# Altium schematic sheet CLKB_main.SchDoc
size A3
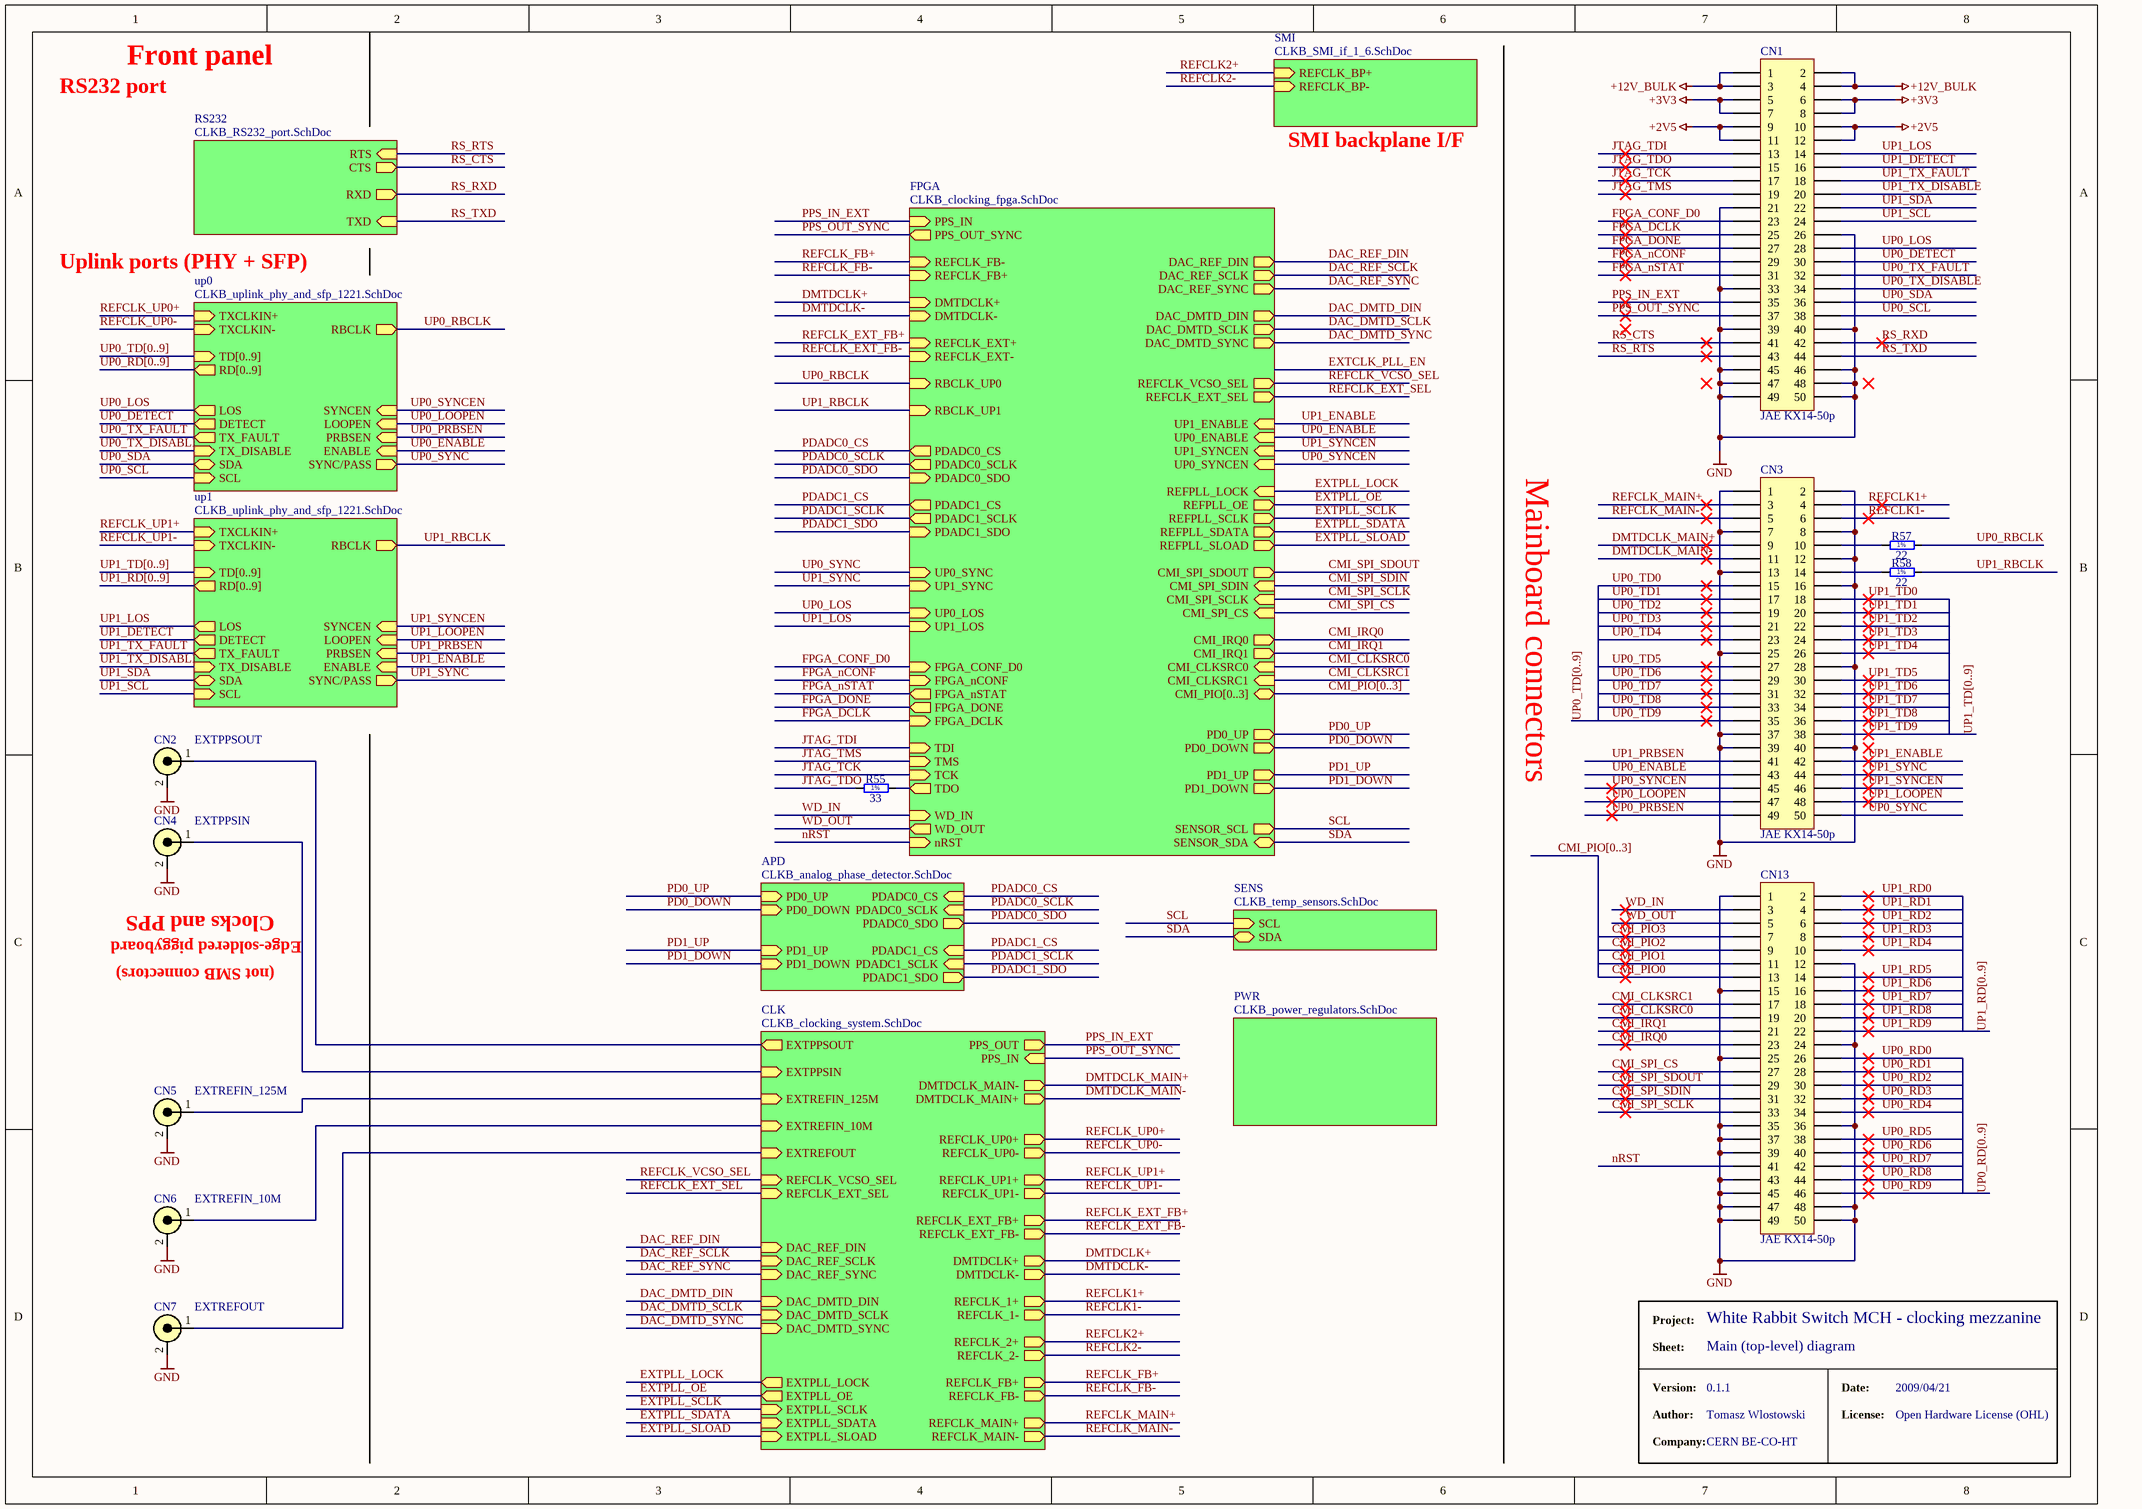
[diagram p0: CLKB_main.SchDoc]

## Parts
CN1  JAE KX14-50p  [JAE_KX14_50P]
CN2  EXTPPSOUT  [MCH_SPECIAL_FP_CLOCKS]
CN3  JAE KX14-50p  [JAE_KX14_50P]
CN4  EXTPPSIN  [MCH_SPECIAL_FP_CLOCKS]
CN5  EXTREFIN_125M  [MCH_SPECIAL_FP_CLOCKS]
CN6  EXTREFIN_10M  [MCH_SPECIAL_FP_CLOCKS]
CN7  EXTREFOUT  [MCH_SPECIAL_FP_CLOCKS]
CN13  JAE KX14-50p  [JAE_KX14_50P]
R55  33  [RESC1608X55N]
R57  22  [RESC1608X55N]
R58  22  [RESC1608X55N]

## Sub-sheets
APD = CLKB_analog_phase_detector.SchDoc: PDADC1_SDO (out), PD0_UP (in), PDADC1_CS (in), PD1_DOWN (in), PD0_DOWN (in), PDADC0_CS (in), PDADC0_SDO (out), PDADC1_SCLK (in), PDADC0_SCLK (in), PD1_UP (in)
CLK = CLKB_clocking_system.SchDoc: EXTREFIN_10M (in), EXTREFIN_125M (in), REFCLK_EXT_SEL (in), EXTREFOUT (in), REFCLK_MAIN+ (out), REFCLK_MAIN- (out), REFCLK_FB+ (out), REFCLK_FB- (out), REFCLK_UP0+ (out), REFCLK_1- (out), REFCLK_2+ (out), REFCLK_2- (out), REFCLK_UP1- (out), REFCLK_1+ (out), DMTDCLK+ (out), DMTDCLK- (out), REFCLK_EXT_FB+ (out), REFCLK_EXT_FB- (out), DAC_DMTD_SYNC (in), DAC_DMTD_SCLK (in), DAC_DMTD_DIN (in), DAC_REF_SYNC (in), DAC_REF_SCLK (in), REFCLK_UP1+ (out), DAC_REF_DIN (in), REFCLK_UP0- (out), DMTDCLK_MAIN+ (out), DMTDCLK_MAIN- (out), REFCLK_VCSO_SEL (in), EXTPPSIN (in), PPS_IN (in), PPS_OUT (out), EXTPPSOUT (out), EXTPLL_LOCK (out), EXTPLL_OE (out), EXTPLL_SLOAD (in), EXTPLL_SDATA (in), EXTPLL_SCLK (in)
FPGA = CLKB_clocking_fpga.SchDoc: TDI (in), TDO (out), TCK (in), TMS (in), REFCLK_FB- (in), DMTDCLK+ (in), DMTDCLK- (in), REFCLK_EXT+ (in), REFCLK_EXT- (in), RBCLK_UP0 (in), RBCLK_UP1 (in), CMI_SPI_SDIN (in), CMI_SPI_SCLK (in), UP0_LOS (in), CMI_SPI_CS (in), CMI_SPI_SDOUT (out), UP1_LOS (in), FPGA_DCLK (in), DAC_REF_SYNC (out), DAC_REF_DIN (out), DAC_REF_SCLK (out), DAC_DMTD_SYNC (out), DAC_DMTD_SCLK (out), DAC_DMTD_DIN (out), CMI_IRQ0 (out), CMI_IRQ1 (out), CMI_CLKSRC0 (in), CMI_CLKSRC1 (in), CMI_PIO[0..3] (bidir), REFCLK_VCSO_SEL (out), REFCLK_EXT_SEL (out), UP0_SYNC (in), PDADC0_CS (out), PDADC0_SDO (in), PDADC0_SCLK (out), UP1_SYNC (in), FPGA_CONF_D0 (in), PDADC1_CS (out), PDADC1_SDO (in), PDADC1_SCLK (out), PD0_UP (out), PD0_DOWN (out), PD1_UP (out), PD1_DOWN (out), FPGA_DONE (out), FPGA_nCONF (in), FPGA_nSTAT (out), REFCLK_FB+ (in), UP1_ENABLE (in), UP0_ENABLE (in), UP1_SYNCEN (in), UP0_SYNCEN (in), WD_IN (in), WD_OUT (out), nRST (in), SENSOR_SCL (out), SENSOR_SDA (bidir), REFPLL_OE (out), REFPLL_SCLK (out), REFPLL_SDATA (out), REFPLL_SLOAD (out), REFPLL_LOCK (in), PPS_IN (in), PPS_OUT_SYNC (out)
PWR = CLKB_power_regulators.SchDoc: no entries
RS232 = CLKB_RS232_port.SchDoc: TXD (in), RXD (out), CTS (out), RTS (in)
SENS = CLKB_temp_sensors.SchDoc: SDA (bidir), SCL (in)
SMI = CLKB_SMI_if_1_6.SchDoc: REFCLK_BP+ (in), REFCLK_BP- (in)
up0 = CLKB_uplink_phy_and_sfp_1221.SchDoc: TD[0..9] (in), TXCLKIN+ (in), TXCLKIN- (in), TX_FAULT (out), TX_DISABLE (in), SDA (bidir), SCL (in), DETECT (out), LOS (out), SYNCEN (in), LOOPEN (in), PRBSEN (in), ENABLE (in), RBCLK (out), SYNC/PASS (out), RD[0..9] (out)
up1 = CLKB_uplink_phy_and_sfp_1221.SchDoc: TD[0..9] (in), TXCLKIN+ (in), TXCLKIN- (in), TX_FAULT (out), TX_DISABLE (in), SDA (bidir), SCL (in), DETECT (out), LOS (out), SYNCEN (in), LOOPEN (in), PRBSEN (in), ENABLE (in), RBCLK (out), SYNC/PASS (out), RD[0..9] (out)

## Nets
+2V5: CN1.9 CN1.10 CN1.11 CN1.12
+3V3: CN1.5 CN1.6 CN1.7 CN1.8
+12V_BULK: CN1.1 CN1.2 CN1.3 CN1.4
GND: CN1.21 CN1.26 CN1.33 CN1.39 CN1.40 CN1.45 CN1.46 CN1.47 CN1.48 CN1.49 CN1.50 CN2.2(GND) CN3.1 CN3.2 CN3.7 CN3.8 CN3.12 CN3.13 CN3.16 CN3.25 CN3.28 CN3.37 CN3.39 CN3.40 CN4.2(GND) CN5.2(GND) CN6.2(GND) CN7.2(GND) CN13.1 CN13.12 CN13.15 CN13.24 CN13.25 CN13.35 CN13.36 CN13.37 CN13.39 CN13.43 CN13.45 CN13.47 CN13.48 CN13.49 CN13.50
CMI_CLKSRC0: CN13.19 ; sheet FPGA/CMI_CLKSRC0
CMI_CLKSRC1: CN13.17 ; sheet FPGA/CMI_CLKSRC1
CMI_IRQ0: CN13.23 ; sheet FPGA/CMI_IRQ0
CMI_IRQ1: CN13.21 ; sheet FPGA/CMI_IRQ1
CMI_PIO0: CN13.13
CMI_PIO1: CN13.11
CMI_PIO2: CN13.9
CMI_PIO3: CN13.7
CMI_SPI_CS: CN13.27 ; sheet FPGA/CMI_SPI_CS
CMI_SPI_SCLK: CN13.33 ; sheet FPGA/CMI_SPI_SCLK
CMI_SPI_SDIN: CN13.31 ; sheet FPGA/CMI_SPI_SDIN
CMI_SPI_SDOUT: CN13.29 ; sheet FPGA/CMI_SPI_SDOUT
DAC_DMTD_DIN: sheet CLK/DAC_DMTD_DIN, sheet FPGA/DAC_DMTD_DIN
DAC_DMTD_SCLK: sheet CLK/DAC_DMTD_SCLK, sheet FPGA/DAC_DMTD_SCLK
DAC_DMTD_SYNC: sheet CLK/DAC_DMTD_SYNC, sheet FPGA/DAC_DMTD_SYNC
DAC_REF_DIN: sheet CLK/DAC_REF_DIN, sheet FPGA/DAC_REF_DIN
DAC_REF_SCLK: sheet CLK/DAC_REF_SCLK, sheet FPGA/DAC_REF_SCLK
DAC_REF_SYNC: sheet CLK/DAC_REF_SYNC, sheet FPGA/DAC_REF_SYNC
DMTDCLK+: sheet CLK/DMTDCLK+, sheet FPGA/DMTDCLK+
DMTDCLK-: sheet CLK/DMTDCLK-, sheet FPGA/DMTDCLK-
DMTDCLK_MAIN+: CN3.9 ; sheet CLK/DMTDCLK_MAIN-
DMTDCLK_MAIN-: CN3.11 ; sheet CLK/DMTDCLK_MAIN+
EXTPLL_LOCK: sheet CLK/EXTPLL_LOCK, sheet FPGA/REFPLL_LOCK
EXTPLL_OE: sheet CLK/EXTPLL_OE, sheet FPGA/REFPLL_OE
EXTPLL_SCLK: sheet CLK/EXTPLL_SCLK, sheet FPGA/REFPLL_SCLK
EXTPLL_SDATA: sheet CLK/EXTPLL_SDATA, sheet FPGA/REFPLL_SDATA
EXTPLL_SLOAD: sheet CLK/EXTPLL_SLOAD, sheet FPGA/REFPLL_SLOAD
FPGA_CONF_D0: CN1.23 ; sheet FPGA/FPGA_CONF_D0
FPGA_DCLK: CN1.25 ; sheet FPGA/FPGA_DCLK
FPGA_DONE: CN1.27 ; sheet FPGA/FPGA_DONE
FPGA_nCONF: CN1.29 ; sheet FPGA/FPGA_nCONF
FPGA_nSTAT: CN1.31 ; sheet FPGA/FPGA_nSTAT
JTAG_TCK: CN1.17 ; sheet FPGA/TCK
JTAG_TDI: CN1.13 ; sheet FPGA/TDI
JTAG_TDO: CN1.15 R55.1
JTAG_TMS: CN1.19 ; sheet FPGA/TMS
nRST: CN13.41 ; sheet FPGA/nRST
PD0_DOWN: sheet APD/PD0_DOWN, sheet FPGA/PD0_DOWN
PD0_UP: sheet APD/PD0_UP, sheet FPGA/PD0_UP
PD1_DOWN: sheet APD/PD1_DOWN, sheet FPGA/PD1_DOWN
PD1_UP: sheet APD/PD1_UP, sheet FPGA/PD1_UP
PDADC0_CS: sheet APD/PDADC0_CS, sheet FPGA/PDADC0_CS
PDADC0_SCLK: sheet APD/PDADC0_SCLK, sheet FPGA/PDADC0_SCLK
PDADC0_SDO: sheet APD/PDADC0_SDO, sheet FPGA/PDADC0_SDO
PDADC1_CS: sheet APD/PDADC1_CS, sheet FPGA/PDADC1_CS
PDADC1_SCLK: sheet APD/PDADC1_SCLK, sheet FPGA/PDADC1_SCLK
PDADC1_SDO: sheet APD/PDADC1_SDO, sheet FPGA/PDADC1_SDO
PPS_IN_EXT: CN1.35 ; sheet CLK/PPS_OUT, sheet FPGA/PPS_IN
PPS_OUT_SYNC: CN1.37 ; sheet CLK/PPS_IN, sheet FPGA/PPS_OUT_SYNC
REFCLK1+: CN3.4 ; sheet CLK/REFCLK_1+
REFCLK1-: CN3.6 ; sheet CLK/REFCLK_1-
REFCLK2+: sheet CLK/REFCLK_2+, sheet SMI/REFCLK_BP+
REFCLK2-: sheet CLK/REFCLK_2-, sheet SMI/REFCLK_BP-
REFCLK_EXT_FB+: sheet CLK/REFCLK_EXT_FB+, sheet FPGA/REFCLK_EXT+
REFCLK_EXT_FB-: sheet CLK/REFCLK_EXT_FB-, sheet FPGA/REFCLK_EXT-
REFCLK_EXT_SEL: sheet CLK/REFCLK_EXT_SEL, sheet FPGA/REFCLK_EXT_SEL
REFCLK_FB+: sheet CLK/REFCLK_FB+, sheet FPGA/REFCLK_FB-
REFCLK_FB-: sheet CLK/REFCLK_FB-, sheet FPGA/REFCLK_FB+
REFCLK_MAIN+: CN3.3 ; sheet CLK/REFCLK_MAIN+
REFCLK_MAIN-: CN3.5 ; sheet CLK/REFCLK_MAIN-
REFCLK_UP0+: sheet CLK/REFCLK_UP0+, sheet up0/TXCLKIN+
REFCLK_UP0-: sheet CLK/REFCLK_UP0-, sheet up0/TXCLKIN-
REFCLK_UP1+: sheet CLK/REFCLK_UP1+, sheet up1/TXCLKIN+
REFCLK_UP1-: sheet CLK/REFCLK_UP1-, sheet up1/TXCLKIN-
REFCLK_VCSO_SEL: sheet CLK/REFCLK_VCSO_SEL, sheet FPGA/REFCLK_VCSO_SEL
RS_CTS: CN1.41 ; sheet RS232/CTS
RS_RTS: CN1.43 ; sheet RS232/RTS
RS_RXD: CN1.42 ; sheet RS232/RXD
RS_TXD: CN1.44 ; sheet RS232/TXD
SCL: sheet FPGA/SENSOR_SCL, sheet SENS/SCL
SDA: sheet FPGA/SENSOR_SDA, sheet SENS/SDA
UP0_DETECT: CN1.30 ; sheet up0/DETECT
UP0_ENABLE: CN3.43 ; sheet FPGA/UP0_ENABLE, sheet up0/ENABLE
UP0_LOOPEN: CN3.47 ; sheet up0/LOOPEN
UP0_LOS: CN1.28 ; sheet FPGA/UP0_LOS, sheet up0/LOS
UP0_PRBSEN: CN3.49 ; sheet up0/PRBSEN
UP0_RBCLK: R57.2 ; sheet FPGA/RBCLK_UP0, sheet up0/RBCLK
UP0_RD0: CN13.26
UP0_RD1: CN13.28
UP0_RD2: CN13.30
UP0_RD3: CN13.32
UP0_RD4: CN13.34
UP0_RD5: CN13.38
UP0_RD6: CN13.40
UP0_RD7: CN13.42
UP0_RD8: CN13.44
UP0_RD9: CN13.46
UP0_SCL: CN1.38 ; sheet up0/SCL
UP0_SDA: CN1.36 ; sheet up0/SDA
UP0_SYNC: CN3.50 ; sheet FPGA/UP0_SYNC, sheet up0/SYNC/PASS
UP0_SYNCEN: CN3.45 ; sheet FPGA/UP0_SYNCEN, sheet up0/SYNCEN
UP0_TD0: CN3.15
UP0_TD1: CN3.17
UP0_TD2: CN3.19
UP0_TD3: CN3.21
UP0_TD4: CN3.23
UP0_TD5: CN3.27
UP0_TD6: CN3.29
UP0_TD7: CN3.31
UP0_TD8: CN3.33
UP0_TD9: CN3.35
UP0_TX_DISABLE: CN1.34 ; sheet up0/TX_DISABLE
UP0_TX_FAULT: CN1.32 ; sheet up0/TX_FAULT
UP1_DETECT: CN1.16 ; sheet up1/DETECT
UP1_ENABLE: CN3.42 ; sheet FPGA/UP1_ENABLE, sheet up1/ENABLE
UP1_LOOPEN: CN3.48 ; sheet up1/LOOPEN
UP1_LOS: CN1.14 ; sheet FPGA/UP1_LOS, sheet up1/LOS
UP1_PRBSEN: CN3.41 ; sheet up1/PRBSEN
UP1_RBCLK: R58.2 ; sheet FPGA/RBCLK_UP1, sheet up1/RBCLK
UP1_RD0: CN13.2
UP1_RD1: CN13.4
UP1_RD2: CN13.6
UP1_RD3: CN13.8
UP1_RD4: CN13.10
UP1_RD5: CN13.14
UP1_RD6: CN13.16
UP1_RD7: CN13.18
UP1_RD8: CN13.20
UP1_RD9: CN13.22
UP1_SCL: CN1.24 ; sheet up1/SCL
UP1_SDA: CN1.22 ; sheet up1/SDA
UP1_SYNC: CN3.44 ; sheet FPGA/UP1_SYNC, sheet up1/SYNC/PASS
UP1_SYNCEN: CN3.46 ; sheet FPGA/UP1_SYNCEN, sheet up1/SYNCEN
UP1_TD0: CN3.18
UP1_TD1: CN3.20
UP1_TD2: CN3.22
UP1_TD3: CN3.24
UP1_TD4: CN3.26
UP1_TD5: CN3.30
UP1_TD6: CN3.32
UP1_TD7: CN3.34
UP1_TD8: CN3.36
UP1_TD9: CN3.38
UP1_TX_DISABLE: CN1.20 ; sheet up1/TX_DISABLE
UP1_TX_FAULT: CN1.18 ; sheet up1/TX_FAULT
WD_IN: CN13.3 ; sheet FPGA/WD_IN
WD_OUT: CN13.5 ; sheet FPGA/WD_OUT
NetCN2_1: CN2.1(HOT) ; sheet CLK/EXTPPSOUT
NetCN3_10: CN3.10 R57.1
NetCN3_14: CN3.14 R58.1
NetCN4_1: CN4.1(HOT) ; sheet CLK/EXTPPSIN
NetCN5_1: CN5.1(HOT) ; sheet CLK/EXTREFIN_125M
NetCN6_1: CN6.1(HOT) ; sheet CLK/EXTREFIN_10M
NetCN7_1: CN7.1(HOT) ; sheet CLK/EXTREFOUT
NetR55_2: R55.2 ; sheet FPGA/TDO

## Buses and harness runs
bus CMI_PIO[0..3]
bus CMI_PIO[0..3] = sheet FPGA/CMI_PIO[0..3]
bus UP0_RD[0..9]
bus UP0_RD[0..9] = sheet up0/RD[0..9]
bus UP0_TD[0..9]
bus UP0_TD[0..9] = sheet up0/TD[0..9]
bus UP1_RD[0..9]
bus UP1_RD[0..9] = sheet up1/RD[0..9]
bus UP1_TD[0..9]
bus UP1_TD[0..9] = sheet up1/TD[0..9]

## Notes on the sheet
- RS232 port
- Front panel
- SMI backplane I/F
- Uplink ports (PHY + SFP)
- Mainboard connectors
- Clocks and PPS
- (not SMB connectors)
- Edge-soldered piggyboard
- Project:
- White Rabbit Switch MCH - clocking mezzanine
- Sheet:
- Version:
- Main (top-level) diagram
- 0.1.1
- Date:
- 2009/04/21
- Author:
- Company:
- Tomasz Wlostowski
- CERN BE-CO-HT
- License:
- Open Hardware License (OHL)
- (in symbol R0603_22R_1%_0.1W_100PPM) 1%
- (in symbol R0603_33R_1%_0.1W_100PPM) 1%

## Library data of the parts
CN1 CN3 CN13 = KX14_50p: multipin B2B connector (plug); Supplier: Farnell
CN2 CN4-CN7 = SMA_SOCKET: SMB piggyboard connection
R55 = R0603_33R_1%_0.1W_100PPM: Resistor - 1%; Part Description: General Purpose Thick Film Chip Resistor; Manufacturer: GENERIC; Manufacturer1 Part Number: NRC06F33R0TRF; Manufacturer1 Datasheet: \\cern.ch\dfs\Applications\Altium\Datasheets\R0603_NIC_NRC.pdf; Power: 0.1W; TC: ±100ppm/°C; Table: Resistors SMD; Part Number: R0603_33R_1%_0.1W_100PPM; Component Kind: Standard; Component Type: Standard; Designator: Resistor - 1%; Library Reference: Resistor - 1%; Pin Count: 2; Value: 33; Status: Preferred; Tolerance: ±1%; Manufacturer Part Number: R0603_33R_1%_0.1W_100PPM; Case: 0603; Mounted: Yes; Socket: No; SMD: Yes; Manufacturer1 Example: NIC COMPONENT; Manufacturer1 ComponentHeight: 0.55mm; HelpURL: \\cern.ch\dfs\Applications\Altium\Datasheets\R0603_NIC_NRC.pdf; Author: CERN DEM JLC; CreateDate: 12/3/2007; LatestRevisionDate: 3/13/2008
R57 R58 = R0603_22R_1%_0.1W_100PPM: Resistor - 1%; Part Description: General Purpose Thick Film Chip Resistor; Manufacturer: GENERIC; Manufacturer1 Part Number: NRC06F22R0TRF; Manufacturer1 Datasheet: \\cern.ch\dfs\Applications\Altium\Datasheets\R0603_NIC_NRC.pdf; Power: 0.1W; TC: ±100ppm/°C; Table: Resistors SMD; Part Number: R0603_22R_1%_0.1W_100PPM; Component Kind: Standard; Component Type: Standard; Designator: Resistor - 1%; Library Reference: Resistor - 1%; Pin Count: 2; Value: 22; Status: Preferred; Tolerance: ±1%; Manufacturer Part Number: R0603_22R_1%_0.1W_100PPM; Case: 0603; Mounted: Yes; Socket: No; SMD: Yes; Manufacturer1 Example: NIC COMPONENT; Manufacturer1 ComponentHeight: 0.55mm; HelpURL: \\cern.ch\dfs\Applications\Altium\Datasheets\R0603_NIC_NRC.pdf; Author: CERN DEM JLC; CreateDate: 12/3/2007; LatestRevisionDate: 3/13/2008